# EAGLE schematic MP_PSU_big (EAGLE 9.7.0)
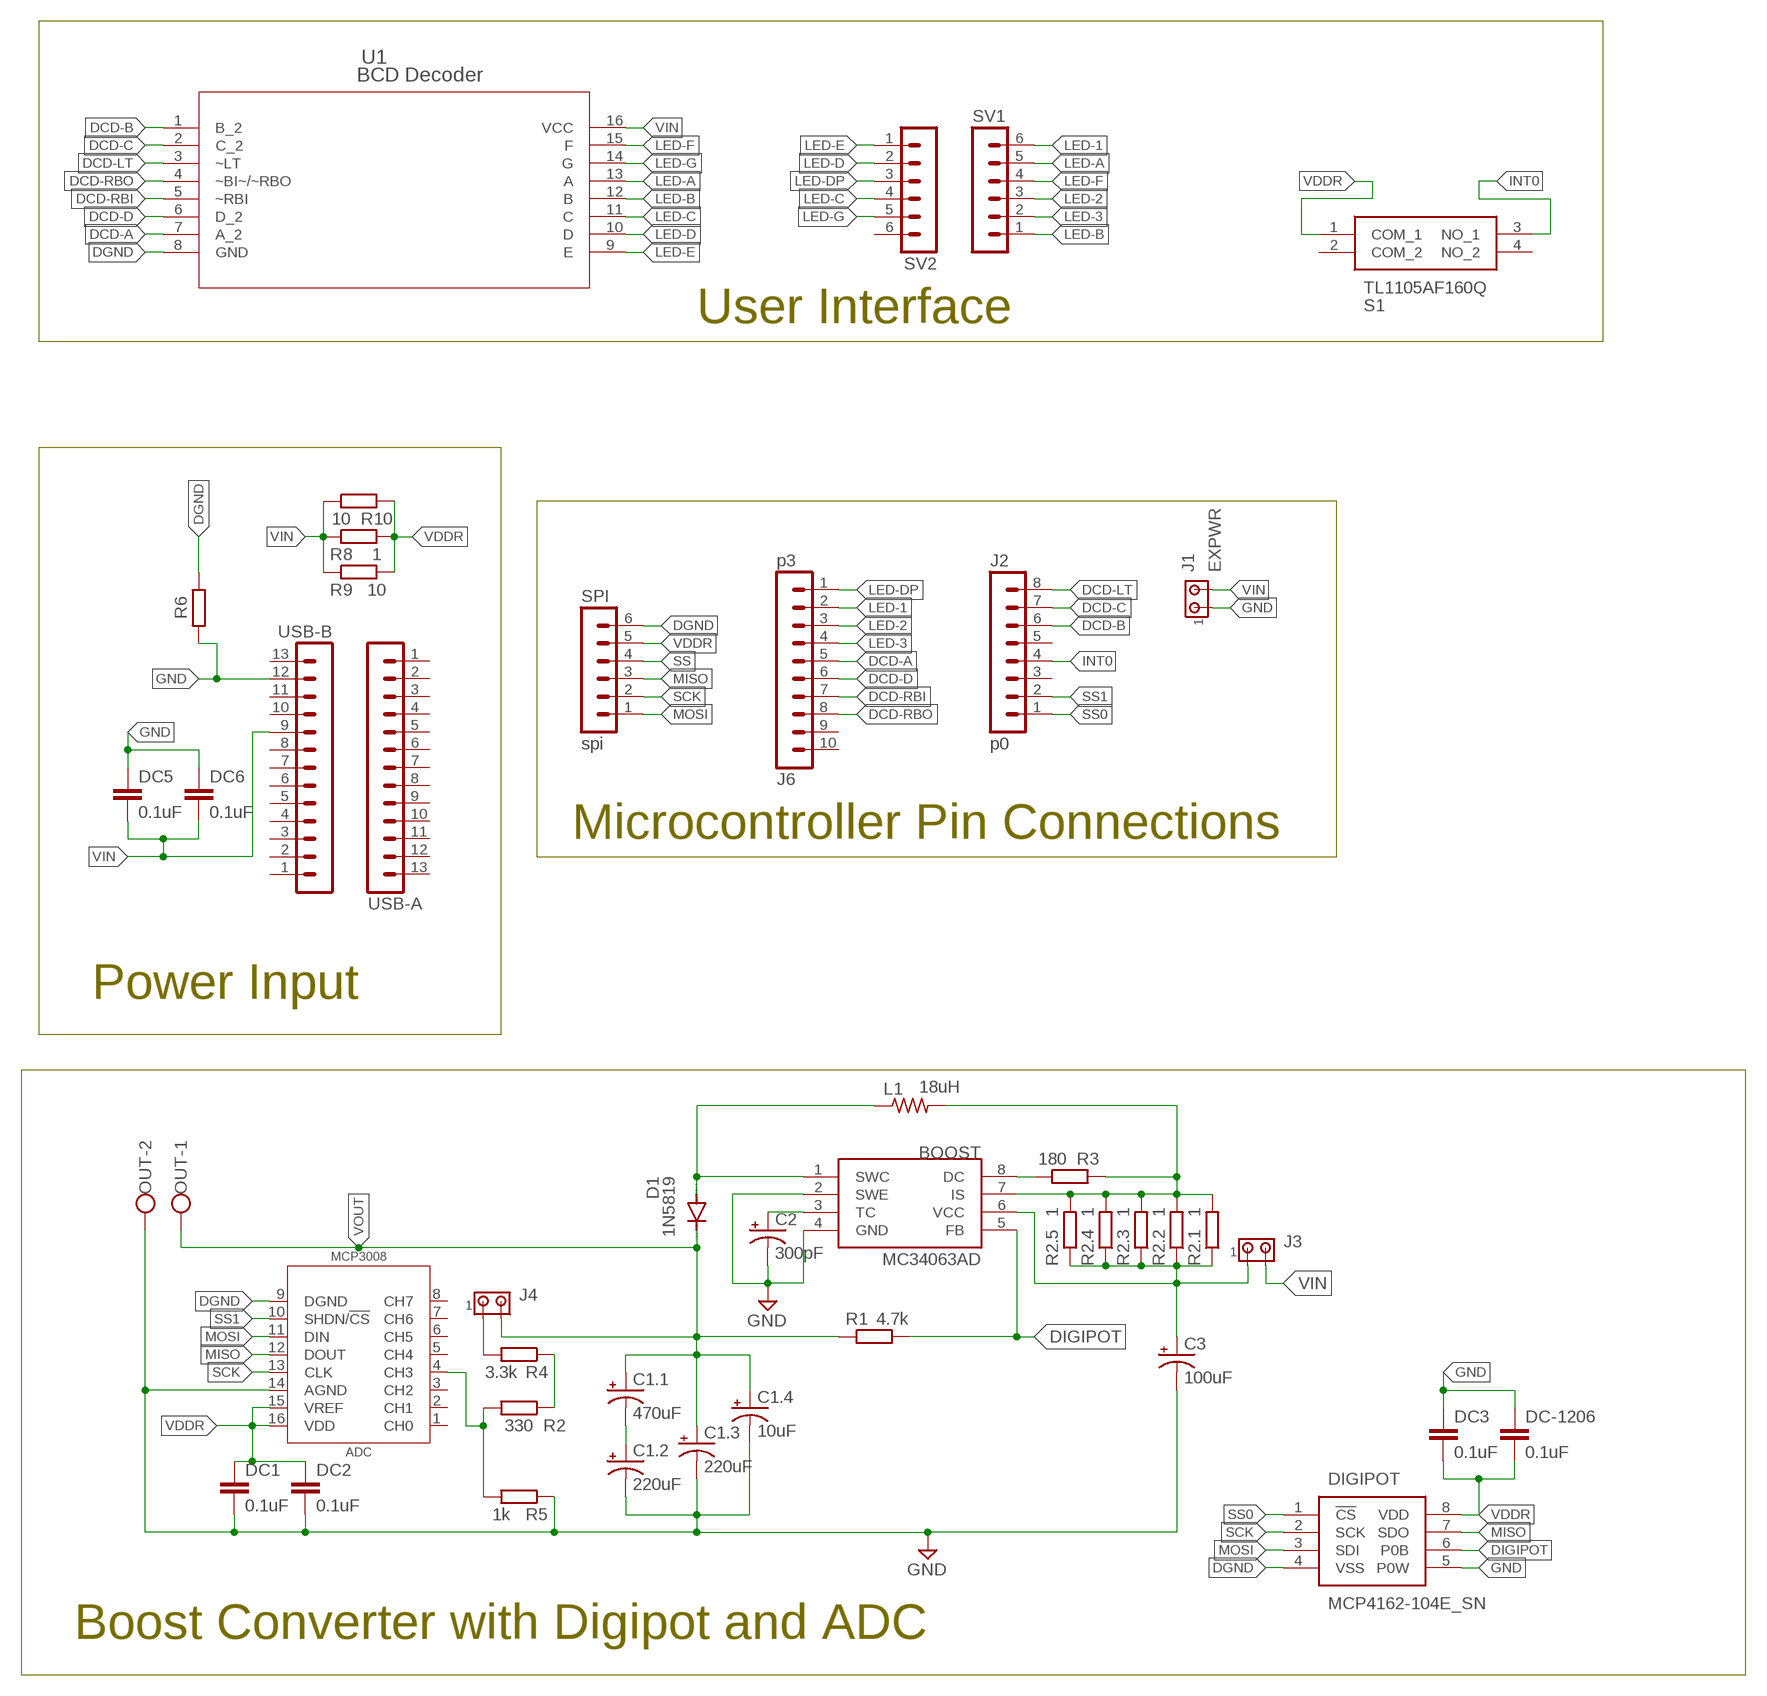
[diagram p0: schematic, sheet 1]

## Parts
ADC  MCP3008  MCP3008_PDIP  [DIP1092W56P254L1905H432Q16B]
BOOST  MC34063AD  [SOIC8]
C1.1  470uF  CAPACITOR_TH_ELECTROLYTIC  [E2,5-6]
C1.2  220uF  CAPACITOR_TH_ELECTROLYTIC  [E2,5-6]
C1.3  220uF  CAPACITOR_TH_ELECTROLYTIC  [E2,5-6]
C1.4  10uF  CAPACITOR_TH_ELECTROLYTIC  [E2,5-6]
C2  300pF  CAPACITOR_TH_ELECTROLYTIC  [E2,5-6]
C3  100uF  CAPACITOR_TH_ELECTROLYTIC  [E2,5-6]
D1  1N5819  1N4007  [DO41-10]
DC1  0.1uF  CAPACITOR_SMD_1206  [C1206]
DC2  0.1uF  CAPACITOR_SMD_1206  [C1206]
DC3  0.1uF  CAPACITOR_SMD_1206  [C1206]
DC5  0.1uF  CAPACITOR_SMD_1206  [C1206]
DC6  0.1uF  CAPACITOR_SMD_1206  [C1206]
DC-1206  0.1uF  CAPACITOR_SMD_1206  [C1206]
DIGIPOT  MCP4162-104E_SN  [SOIC127P600X175-8N]
J1  EXPWR  MTA02-100  [10X02MTA]
J2  p0  MA08-1  [MA08-1]
J3  MTA02-100  [10X02MTA]
J4  MTA02-100  [10X02MTA]
J6  p3  MA10-1  [MA10-1]
L1  18uH  RESISTOR_1/4W_0207/10  [0207/10]
OUT  W237-102  [W237-102]
R1  4.7k  R_AXIAL-7.2MM-PITCH  [RESAD724W46L381D178B]
R2  330  R_AXIAL-7.2MM-PITCH  [RESAD724W46L381D178B]
R2.1  1  R_AXIAL-7.2MM-PITCH  [RESAD724W46L381D178B]
R2.2  1  R_AXIAL-7.2MM-PITCH  [RESAD724W46L381D178B]
R2.3  1  R_AXIAL-7.2MM-PITCH  [RESAD724W46L381D178B]
R2.4  1  R_AXIAL-7.2MM-PITCH  [RESAD724W46L381D178B]
R2.5  1  R_AXIAL-7.2MM-PITCH  [RESAD724W46L381D178B]
R3  180  R_AXIAL-7.2MM-PITCH  [RESAD724W46L381D178B]
R4  3.3k  R_AXIAL-7.2MM-PITCH  [RESAD724W46L381D178B]
R5  1k  R_AXIAL-7.2MM-PITCH  [RESAD724W46L381D178B]
R6  R_AXIAL-7.2MM-PITCH  [RESAD724W46L381D178B]
R8  1  R_AXIAL-7.2MM-PITCH  [RESAD724W46L381D178B]
R9  10  R_AXIAL-7.2MM-PITCH  [RESAD724W46L381D178B]
R10  10  R_AXIAL-7.2MM-PITCH  [RESAD724W46L381D178B]
S1  TL1105AF160Q  [TL1105AF160Q]
SPI  spi  MA06-1  [MA06-1]
SV1  MA06-1  [MA06-1]
SV2  MA06-1  [MA06-1]
U1  BCD Decoder  SN7448NDIP16_300  [DIP16_300]
USB-A  MA13-1  [MA13-1]
USB-B  MA13-1  [MA13-1]

## Nets
B-VIN: BOOST.6(VCC) C3.+ J3.1 R2.1.1 R2.2.1 R2.3.1 R2.4.1 R2.5.1
DCD-A: J6.5 U1.7(A_2)
DCD-B: J2.6 U1.1(B_2)
DCD-C: J2.7 U1.2(C_2)
DCD-D: J6.6 U1.6(D_2)
DCD-LT: J2.8 U1.3(~LT)
DCD-RBI: J6.7 U1.5(~RBI)
DCD-RBO: J6.8 U1.4(~BI~/~RBO)
DGND: ADC.9(DGND) DIGIPOT.4(VSS) R6.1 SPI.6 U1.8(GND)
DIGIPOT: BOOST.5(FB) DIGIPOT.6(P0B) R1.2
GND: ADC.14(AGND) BOOST.2(SWE) BOOST.4(GND) C1.2.- C1.3.- C1.4.- C2.- C3.- DC1.2 DC2.2 DC3.1 DC5.1 DC6.1 DC-1206.1 DIGIPOT.5(P0W) J1.1 OUT.2 R5.1 R6.2 USB-B.12
INT0: J2.4 S1.3(NO_1)
LED-1: J6.2 SV1.6
LED-2: J6.3 SV1.3
LED-3: J6.4 SV1.2
LED-A: SV1.5 U1.13(A)
LED-B: SV1.1 U1.12(B)
LED-C: SV2.4 U1.11(C)
LED-D: SV2.2 U1.10(D)
LED-DP: J6.1 SV2.3
LED-E: SV2.1 U1.9(E)
LED-F: SV1.4 U1.15(F)
LED-G: SV2.5 U1.14(G)
MISO: ADC.12(DOUT) DIGIPOT.7(SDO) SPI.3
MOSI: ADC.11(DIN) DIGIPOT.3(SDI) SPI.1
N$1: BOOST.7(IS) L1.2 R2.1.2 R2.2.2 R2.3.2 R2.4.2 R2.5.2 R3.2
N$2: BOOST.8(DC) R3.1
N$3: BOOST.1(SWC) D1.A L1.1
N$5: BOOST.3(TC) C2.+
N$7: J4.1 R4.2
N$9: C1.1.- C1.2.+
N$10: R2.1 R4.1
N$11: ADC.4(CH3) R2.2 R5.2
SCK: ADC.13(CLK) DIGIPOT.2(SCK) SPI.2
SS: SPI.4
SS0: DIGIPOT.1(!CS) J2.1
SS1: ADC.10(SHDN/!CS) J2.2
VDDR: ADC.15(VREF) ADC.16(VDD) DC1.1 DC2.1 DC3.2 DC-1206.2 DIGIPOT.8(VDD) R8.2 R9.2 R10.2 S1.1(COM_1) SPI.5
VIN: DC5.2 DC6.2 J1.2 J3.2 R8.1 R9.1 R10.1 U1.16(VCC) USB-B.9
VOUT: C1.1.+ C1.3.+ C1.4.+ D1.C J4.2 OUT.1 R1.1
Unconnected: ADC.1(CH0) ADC.2(CH1) ADC.3(CH2) ADC.5(CH4) ADC.6(CH5) ADC.7(CH6) ADC.8(CH7) J2.3 J2.5 J6.9 J6.10 S1.2(COM_2) S1.4(NO_2) SV2.6 USB-A.1 USB-A.2 USB-A.3 USB-A.4 USB-A.5 USB-A.6 USB-A.7 USB-A.8 USB-A.9 USB-A.10 USB-A.11 USB-A.12 USB-A.13 USB-B.1 USB-B.2 USB-B.3 USB-B.4 USB-B.5 USB-B.6 USB-B.7 USB-B.8 USB-B.10 USB-B.11 USB-B.13

## Notes on the sheet
- User Interface
- Microcontroller Pin Connections
- Power Input
- Boost Converter with Digipot and ADC

## Library data of the parts
ADC = IC_Data-Conversion:MCP3008: 2.7V 4-Channel/8-Channel 10-Bit A/D Converters with SPI™ Serial Interface Datasheet <https://www.mouser.in/datasheet/2/268/21295b-72710.pdf>; CATEGORY: IC_Data-Conversion; DESCRIPTION: IC ADC 10BIT SAR 16DIP; MANUFACTURER: Microchip Technology; MPN: MCP3008-I/P; OPERATINGTEMP: -40 to +85°C; PART_STATUS: Active; ROHS_COMPLIANT: Compliant; SUB-CATEGORY: A/D Converter
BOOST = mc34063:MC34063
C1.1-C1.4 C2 C3 = BASIC_Components:CAPACITOR_TH_ELECTROLYTIC
D1 = BASIC_Components:1N4007
DC1-DC3 DC5 DC6 DC-1206 = BASIC_Components:CAPACITOR_SMD_1206
DIGIPOT = MCP4162-104E_SN:MCP4162-104E_SN: Digital Potentiometer 256 Step 100kOhm Source: Datasheet <http://ww1.microchip.com/downloads/en/DeviceDoc/22059b.pdf>; DESCRIPTION: Digital Potentiometer 256 Step 100kOhm; HEIGHT: 1.75mm; MANUFACTURER_NAME: Microchip; MANUFACTURER_PART_NUMBER: MCP4162-104E/SN; MOUSER_PART_NUMBER: 579-MCP4162-104E/SN; MOUSER_PRICE-STOCK: https://www.mouser.co.uk/ProductDetail/Microchip-Technology-Atmel/MCP4162-104E-SN?qs=hH%252BOa0VZEiAyFbEnDIqKaA%3D%3D
J1 J3 J4 = con-amp:MTA02-100: AMP connector
J2 = con-lstb:MA08-1: PIN HEADER; OC_FARNELL: unknown; OC_NEWARK: unknown
J6 = con-lstb:MA10-1: PIN HEADER; OC_FARNELL: unknown; OC_NEWARK: unknown
L1 = BASIC_Components:RESISTOR_1/4W_0207/10
OUT = BASIC_Components:W237-102: WAGO SCREW CLAMP; MPN: 237-102; OC_FARNELL: unknown; OC_NEWARK: 70K9898
R1 R2 R2.1-R2.5 R3-R6 R8-R10 = Resistor:R: Resistor Fixed - Generic; CATEGORY: Resistor; SUB-CATEGORY: Fixed
S1 = TL1105AF160Q:TL1105AF160Q: E-SWITCH - TL1105AF160Q - SWITCH, TACTILE SPST, 50mA, THROUGH HOLE Source: Datasheet <https://componentsearchengine.com/Datasheets/1/TL1105AF160Q.pdf>; DESCRIPTION: E-SWITCH - TL1105AF160Q - SWITCH, TACTILE SPST, 50mA, THROUGH HOLE; HEIGHT: 6.8mm; MANUFACTURER_NAME: E-Switch; MANUFACTURER_PART_NUMBER: TL1105AF160Q; MOUSER_PART_NUMBER: 612-TL1105A; MOUSER_PRICE-STOCK: https://www.mouser.co.uk/ProductDetail/E-Switch/TL1105AF160Q?qs=YXf4ACKMM4wdc4witUH7eQ%3D%3D
SPI = con-lstb:MA06-1: PIN HEADER; OC_FARNELL: unknown; OC_NEWARK: unknown
SV1 SV2 = con-lstb:MA06-1: PIN HEADER
U1 = 2023-03-22_10-19-04_Library:SN7448N; COPYRIGHT: Copyright (C) 2023 Ultra Librarian. All rights reserved.; MANUFACTURER_PART_NUMBER: SN7448N; MFR_NAME: Texas Instruments
USB-A USB-B = con-lstb:MA13-1: PIN HEADER